# EAGLE schematic seven-segment (EAGLE 9.6.2)
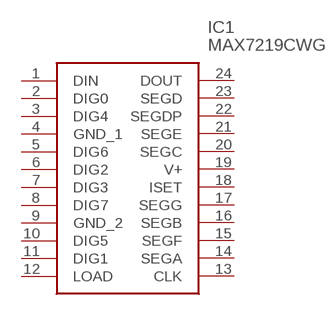
[diagram p0: schematic, sheet 1]

## Parts
IC1  MAX7219CWG  [SOIC127P1032X265-24N]
Unconnected: IC1.1(DIN) IC1.2(DIG0) IC1.3(DIG4) IC1.4(GND_1) IC1.5(DIG6) IC1.6(DIG2) IC1.7(DIG3) IC1.8(DIG7) IC1.9(GND_2) IC1.10(DIG5) IC1.11(DIG1) IC1.12(LOAD) IC1.13(CLK) IC1.14(SEGA) IC1.15(SEGF) IC1.16(SEGB) IC1.17(SEGG) IC1.18(ISET) IC1.19(V+) IC1.20(SEGC) IC1.21(SEGE) IC1.22(SEGDP) IC1.23(SEGD) IC1.24(DOUT)

## Library data of the parts
IC1 = SamacSys_Parts:MAX7219CWG: IC DRVR 7 SEGMNT 8 DIGIT 24SOIC Source: Datasheet <http://datasheets.maximintegrated.com/en/ds/MAX7219-MAX7221.pdf>; DESCRIPTION: IC DRVR 7 SEGMNT 8 DIGIT 24SOIC; HEIGHT: 2.65mm; MANUFACTURER_NAME: Maxim Integrated; MANUFACTURER_PART_NUMBER: MAX7219CWG; MOUSER_PART_NUMBER: 700-MAX7219CWG-NR; MOUSER_PRICE-STOCK: https://www.mouser.co.uk/ProductDetail/Maxim-Integrated/MAX7219CWG?qs=p6VZ%252BklCkRRXY8S0D%252BcNmA%3D%3D